# EAGLE schematic Solar ve rüzgar kartı (EAGLE 9.6.2)
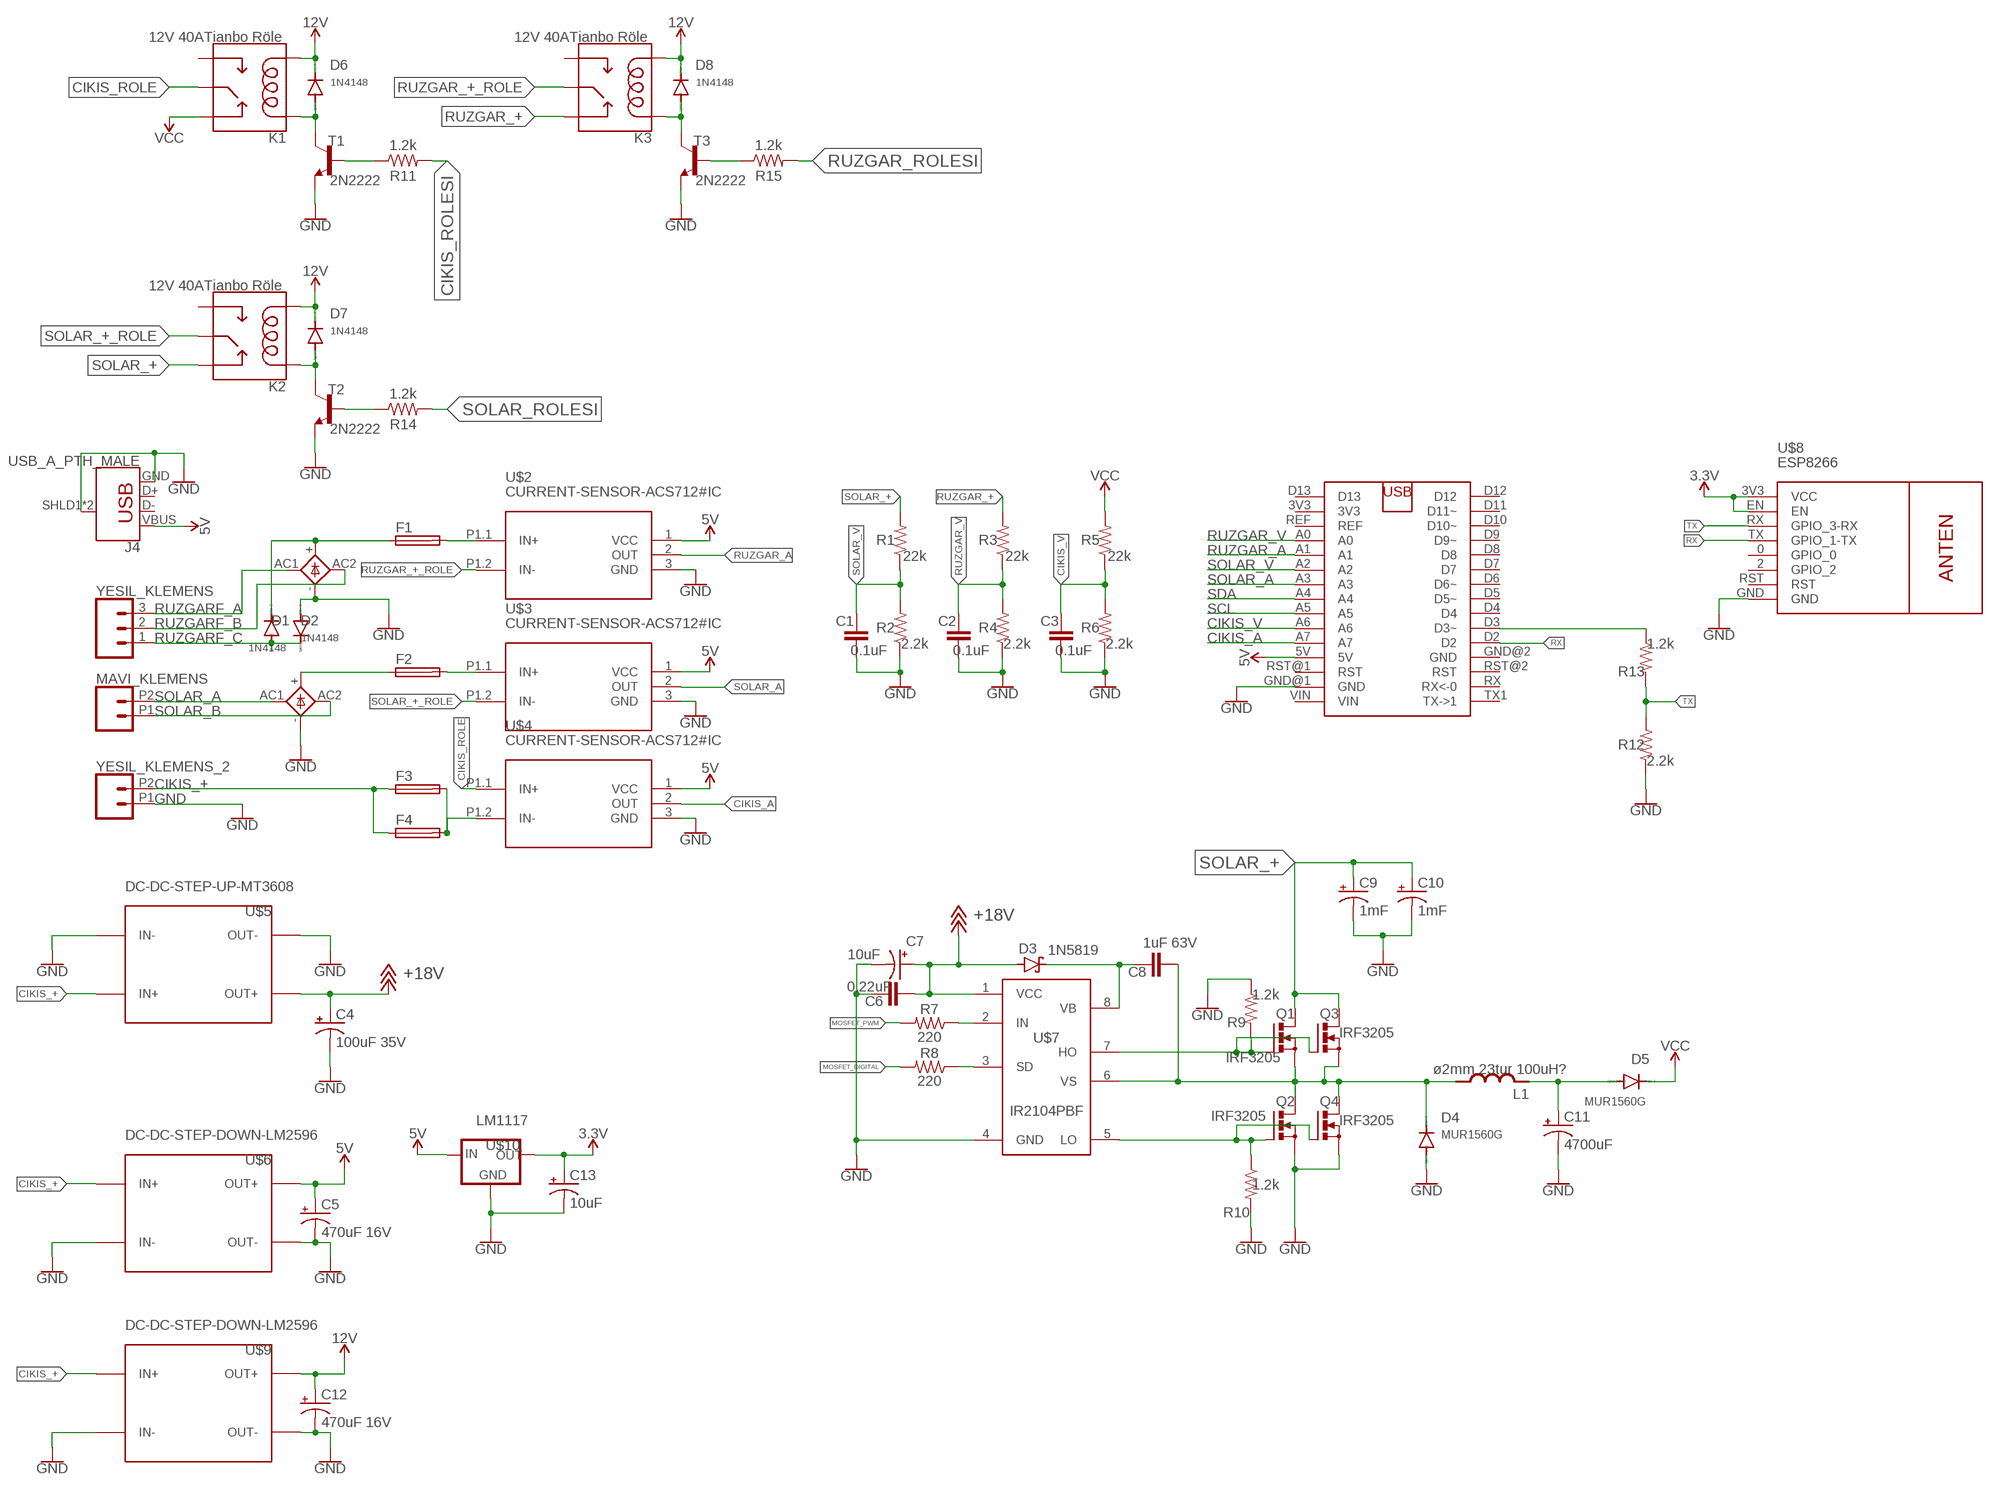
[diagram p0: schematic, sheet 1]

## Parts
B1  FB15  [FB15]
B2  FB15  [FB15]
C1  0.1uF  0.1UF-KIT-EZ-50V-20%  [CAP-PTH-SMALL-KIT]
C2  0.1uF  0.1UF-KIT-EZ-50V-20%  [CAP-PTH-SMALL-KIT]
C3  0.1uF  0.1UF-KIT-EZ-50V-20%  [CAP-PTH-SMALL-KIT]
C4  100uF 35V  100UF-POLAR-RADIAL-2.5MM-25V-20%  [CPOL-RADIAL-2.5MM-6.5MM]
C5  470uF 16V  100UF-POLAR-RADIAL-2.5MM-25V-20%  [CPOL-RADIAL-2.5MM-6.5MM]
C6  0.22uF  0.1UF-KIT-EZ-50V-20%  [CAP-PTH-SMALL-KIT]
C7  10uF  10UF-POLAR-RADIAL-2.5MM-25V-20%  [CPOL-RADIAL-2.5MM-5MM]
C8  1uF 63V  0.1UF-KIT-EZ-50V-20%  [CAP-PTH-SMALL-KIT]
C9  1mF  1000UF-RADIAL-5MM-25V-20%  [CPOL-RADIAL-5MM-10MM]
C10  1mF  1000UF-RADIAL-5MM-25V-20%  [CPOL-RADIAL-5MM-10MM]
C11  4700uF  1000UF-RADIAL-5MM-25V-20%  [CPOL-RADIAL-5MM-10MM]
C12  470uF 16V  100UF-POLAR-RADIAL-2.5MM-25V-20%  [CPOL-RADIAL-2.5MM-6.5MM]
C13  10uF  10UF-POLAR-RADIAL-2.5MM-25V-20%  [CPOL-RADIAL-2.5MM-5MM]
D1  1N4148  1N4148DO35-7  [DO35-7]
D2  1N4148  1N4148DO35-7  [DO35-7]
D3  1N5819  1N5819-B  [DO41-7.6]
D4  MUR1560G  DIODE-TO220V  [TO220ACS]
D5  MUR1560G  DIODE-TO220V  [TO220ACS]
D6  1N4148  1N4148DO35-7  [DO35-7]
D7  1N4148  1N4148DO35-7  [DO35-7]
D8  1N4148  1N4148DO35-7  [DO35-7]
F1  19560  [19560]
F2  19560  [19560]
F3  19560  [19560]
F4  19560  [19560]
J4  USB_A_PTH_MALE  [USB-A-H]
K1  12V 40ATianbo Röle  RELAY-SPDT-JZC-11F  [RELAY-JZC]
K2  12V 40ATianbo Röle  RELAY-SPDT-JZC-11F  [RELAY-JZC]
K3  12V 40ATianbo Röle  RELAY-SPDT-JZC-11F  [RELAY-JZC]
L1  ø2mm 23tur 100uH?  L10-2  [L10-2]
MAVI_KLEMENS  CONN_022.54MM_SCREWTERM  [1X02_2.54_SCREWTERM]
Q1  IRF3205  PMOSFET_NTO220BV  [TO220BV]
Q2  IRF3205  PMOSFET_NTO220BV  [TO220BV]
Q3  IRF3205  PMOSFET_NTO220BV  [TO220BV]
Q4  IRF3205  PMOSFET_NTO220BV  [TO220BV]
R1  22k  RESISTORAXIAL-0.3  [AXIAL-0.3]
R2  2.2k  RESISTORAXIAL-0.3  [AXIAL-0.3]
R3  22k  RESISTORAXIAL-0.3  [AXIAL-0.3]
R4  2.2k  RESISTORAXIAL-0.3  [AXIAL-0.3]
R5  22k  RESISTORAXIAL-0.3  [AXIAL-0.3]
R6  2.2k  RESISTORAXIAL-0.3  [AXIAL-0.3]
R7  220  RESISTORAXIAL-0.3  [AXIAL-0.3]
R8  220  RESISTORAXIAL-0.3  [AXIAL-0.3]
R9  1.2k  RESISTORAXIAL-0.3  [AXIAL-0.3]
R10  1.2k  RESISTORAXIAL-0.3  [AXIAL-0.3]
R11  1.2k  RESISTORAXIAL-0.3  [AXIAL-0.3]
R12  2.2k  RESISTORAXIAL-0.3  [AXIAL-0.3]
R13  1.2k  RESISTORAXIAL-0.3  [AXIAL-0.3]
R14  1.2k  RESISTORAXIAL-0.3  [AXIAL-0.3]
R15  1.2k  RESISTORAXIAL-0.3  [AXIAL-0.3]
T1  2N2222  2N2222-NPN-TO92-EBC  [TO92-EBC]
T2  2N2222  2N2222-NPN-TO92-EBC  [TO92-EBC]
T3  2N2222  2N2222-NPN-TO92-EBC  [TO92-EBC]
U$1  ARDUINO_NANO  [ARDUINO_NANO]
U$2  CURRENT-SENSOR-ACS712#IC  [CURRENT-SENSOR-ACS712#IC]
U$3  CURRENT-SENSOR-ACS712#IC  [CURRENT-SENSOR-ACS712#IC]
U$4  CURRENT-SENSOR-ACS712#IC  [CURRENT-SENSOR-ACS712#IC]
U$5  DC-DC-STEP-UP-MT3608  [DC-DC-STEP-UP-MT3608]
U$6  DC-DC-STEP-DOWN-LM2596  [DC-DC-STEP-DOWN-LM2596]
U$7  IR2104PBF  [DIP-8]
U$8  ESP8266  [ESP8266]
U$9  DC-DC-STEP-DOWN-LM2596  [DC-DC-STEP-DOWN-LM2596]
U$10  LM1117  [TO-220]
YESIL_KLEMENS  CONN_03-SCREW-5MM  [SCREWTERMINAL-5MM-3]
YESIL_KLEMENS_2  CONN_022.54MM_SCREWTERM  [1X02_2.54_SCREWTERM]

## Nets
3.3V: C13.1(+) U$8.3V3(VCC) U$8.EN U$10.2(OUT)
5V: C5.1(+) J4.VBUS U$1.5V U$2.1(VCC) U$3.1(VCC) U$4.1(VCC) U$6.OUT+ U$10.3(IN)
12V: C12.1(+) D6.C D7.C D8.C K1.1(COIL2) K2.1(COIL2) K3.1(COIL2) U$9.OUT+
+18V: C4.1(+) C6.2 C7.1(+) D3.A U$5.OUT+ U$7.1(VCC)
CIKIS_+: F3.1 F4.1 U$5.IN+ U$6.IN+ U$9.IN+ YESIL_KLEMENS_2.P2
CIKIS_A: U$1.A7 U$4.2(OUT)
CIKIS_ROLE: K1.4(MAIN) U$4.P1.1(IN+)
CIKIS_ROLESI: R11.P$2
CIKIS_V: C3.1 R5.P$1 R6.P$2 U$1.A6
GND: B1.- B2.- C1.2 C2.2 C3.2 C4.2(-) C5.2(-) C6.1 C7.2(-) C9.- C10.- C11.- C12.2(-) C13.2(-) D2.A D4.A J4.GND J4.SHLD1(SHIELD) J4.SHLD2(SHIELD) Q2.S Q4.S R2.P$1 R4.P$1 R6.P$1 R9.P$1 R10.P$2 R12.P$1 T1.E T2.E T3.E U$1.GND@1(GND) U$2.3(GND) U$3.3(GND) U$4.3(GND) U$5.IN- U$5.OUT- U$6.IN- U$6.OUT- U$7.4(GND) U$8.GND U$9.IN- U$9.OUT- U$10.1(GND) YESIL_KLEMENS_2.P1
MOSFET_DIGITAL: R8.P$2
MOSFET_PWM: R7.P$2
N$1: B1.+ F2.1
N$2: F1.2 U$2.P1.1(IN+)
N$3: B2.+ D1.C F1.1
N$4: F2.2 U$3.P1.1(IN+)
N$5: F3.2 F4.2 U$4.P1.2(IN-)
N$6: R7.P$1 U$7.2(IN)
N$7: R8.P$1 U$7.3(SD)
N$8: C8.1 D3.C U$7.8(VB)
N$9: C8.2 D4.C L1.P$1 L1.P$2 Q1.S Q2.D Q3.S Q4.D U$7.6(VS)
N$10: Q2.G Q4.G R10.P$1 U$7.5(LO)
N$11: Q1.G Q3.G R9.P$2 U$7.7(HO)
N$12: C11.+ D5.A L1.P$3 L1.P$4
N$13: R13.P$1 U$1.D3(D3~)
N$14: D6.A K1.5(COIL1) T1.C
N$15: R11.P$1 T1.B
N$16: D7.A K2.5(COIL1) T2.C
N$17: R14.P$1 T2.B
N$18: D8.A K3.5(COIL1) T3.C
N$19: R15.P$1 T3.B
RUZGAR_+: K3.2(NC) R3.P$2
RUZGAR_+_ROLE: K3.4(MAIN) U$2.P1.2(IN-)
RUZGAR_A: U$1.A1 U$2.2(OUT)
RUZGAR_ROLESI: R15.P$2
RUZGAR_V: C2.1 R3.P$1 R4.P$2 U$1.A0
RUZGARF_A: B2.AC1 YESIL_KLEMENS.3
RUZGARF_B: B2.AC2 YESIL_KLEMENS.2
RUZGARF_C: D1.A D2.C YESIL_KLEMENS.1
RX: U$1.D2 U$8.TX(GPIO_1-TX)
SCL: U$1.A5
SDA: U$1.A4
SOLAR_+: C9.+ C10.+ K2.2(NC) Q1.D Q3.D R1.P$2
SOLAR_+_ROLE: K2.4(MAIN) U$3.P1.2(IN-)
SOLAR_A: B1.AC1 MAVI_KLEMENS.P2 U$1.A3 U$3.2(OUT)
SOLAR_B: B1.AC2 MAVI_KLEMENS.P1
SOLAR_ROLESI: R14.P$2
SOLAR_V: C1.1 R1.P$1 R2.P$2 U$1.A2
TX: R12.P$2 R13.P$2 U$8.RX(GPIO_3-RX)
VCC: D5.C K1.2(NC) R5.P$2
Unconnected: J4.D+ J4.D- K1.3(NO) K2.3(NO) K3.3(NO) U$1.3V3 U$1.D4 U$1.D5(D5~) U$1.D6(D6~) U$1.D7 U$1.D8 U$1.D9(D9~) U$1.D10(D10~) U$1.D11(D11~) U$1.D12 U$1.D13 U$1.GND@2(GND) U$1.REF U$1.RST@1(RST) U$1.RST@2(RST) U$1.RX(RX<-0) U$1.TX1(TX->1) U$1.VIN U$8.0(GPIO_0) U$8.2(GPIO_2) U$8.RST

## Library data of the parts
B1 B2 = rectifier:FB15: FAGOR RECTIFIER grid 3 x 5 mm
C1-C3 = SparkFun-Capacitors:0.1UF: 0.1µF ceramic capacitors A capacitor is a passive two-terminal electrical component used to store electrical energy temporarily in an electric field.; PROD_ID: CAP-08370
C4 C5 C12 = SparkFun-Capacitors:100UF-POLAR: 100µF polarized capacitors A capacitor is a passive two-terminal electrical component used to store electrical energy temporarily in an electric field.; PROD_ID: CAP-08439; VALUE: 100uF
C6 C8 = SparkFun-Capacitors:0.1UF: 0.1µF ceramic capacitors A capacitor is a passive two-terminal electrical component used to store electrical energy temporarily in an electric field.; PROD_ID: CAP-08370; VALUE: 0.1uF
C7 C13 = SparkFun-Capacitors:10UF-POLAR: 10.0µF polarized capacitors A capacitor is a passive two-terminal electrical component used to store electrical energy temporarily in an electric field.; PROD_ID: CAP-08440
C9 C10 = SparkFun-Capacitors:1000UF: 1,000µF/1mF ceramic capacitors A capacitor is a passive two-terminal electrical component used to store electrical energy temporarily in an electric field. CAP-08070; PROD_ID: CAP-09538
C11 = SparkFun-Capacitors:1000UF: 1,000µF/1mF ceramic capacitors A capacitor is a passive two-terminal electrical component used to store electrical energy temporarily in an electric field. CAP-08070; PROD_ID: CAP-09538; VALUE: 1mF
D1 D2 D6-D8 = diode:1N4148: DIODE high speed (Philips)
D3 = diode:1N581*: 1.0A SCHOTTKY BARRIER RECTIFIER Source: http://www.diodes.com/datasheets/ds23001.pdf
D4 D5 = diode:DIODE-: DIODE
F1-F4 = fuse:19560: FUSE HOLDER TR5, Wickmann; MPN: 56000001009; OC_FARNELL: 1185363; OC_NEWARK: 15P8392
J4 = SparkFun-Connectors:USB_A: USB-A Connector Male and female variants, as well as PTH and SMT variants SparkFun Products: SparkFun XBee Explorer Dongle <https://www.sparkfun.com/products/11697> PTH Male SparkFun MicroView-USB Programmer <https://www.sparkfun.com/products/12924> SMT Male SparkFun USB Type A Female Breakout <https://www.sparkfun.com/products/12700> SMT Female; PROD_ID: CONN-08367; SF_ID: PRT-00437
K1-K3 = SparkFun-Electromechanical:RELAY-SPDT: SPDT Electromechanical Relay Single-pole, double-throw sealed relays. When current is applied to the coil, it throws a simple changeover switch, terminating the connection from the NC contact to ground and closing the NO contact. Use them to switch high voltage/high current devices. SparkFun Products JQX-15F: Relay SPDT Sealed - 20A <https://www.sparkfun.com/products/10924> (COM-10924) JZC-11F: Relay SPDT Sealed <https://www.sparkfun.com/products/100> (COM-00100); PROD_ID: COMP-09533; SF_SKU: COM-00100
L1 = lbr:L10-2
MAVI_KLEMENS YESIL_KLEMENS_2 = SparkFun-Connectors:CONN_02: Multi connection point. Often used as Generic Header-pin footprint for 0.1 inch spaced/style header connections On any of the 0.1 inch spaced packages, you can populate with these: Break Away Headers - Straight <https://www.sparkfun.com/products/116> (PRT-00116) Break Away Male Headers - Right Angle <https://www.sparkfun.com/products/553> (PRT-00553) Female Headers <https://www.sparkfun.com/products/115> (PRT-00115) Break Away Headers - Machine Pin <https://www.sparkfun.com/products/117> (PRT-00117) Break Away Female Headers - Swiss Machine Pin <https://www.sparkfun.com/products/743> (PRT-00743) For SCREWTERMINALS and SPRING TERMINALS visit here: Screw Terimnals on SparkFun.com <https://www.sparkfun.com/search/results?term=Screw+Terminals> (5mm/3.5mm/2.54mm spacing) This device is also useful as a general connection point to wire up your design to another part of your project. Our various solder wires solder well into these plated through hole pads. Hook-Up Wire - Assortment (Stranded, 22 AWG) <https://www.sparkfun.com/products/11375> (PRT-11375) Hook-Up Wire - Assortment (Solid Core, 22 AWG) <https://www.sparkfun.com/products/11367> (PRT-11367) View the entire wire category on our website here <https://www.sparkfun.com/categories/141> Special notes: Molex polarized connector foot print use with: PRT-08233 with associated crimp pins and housings. 2.54_SCREWTERM for use with PRT-10571. 3.5mm Screw Terminal footprints for PRT-08084 5mm Screw Terminal footprints for use with PRT-08432
Q1-Q4 = transistor-power:PMOSFET_N: Power MOSFET N-Channel
R1-R15 = SparkFun-Resistors:RESISTOR: Generic Resistor Package
T1-T3 = transistor-neu-to92:*-NPN-: NPN Transistror
U$1 = El_yapimi:ARDUINO_NANO
U$2-U$4 = diy-modules:CURRENT-SENSOR-ACS712#IC: Isolated Bipolar Current Sensors based on ACS712 chip Symbol with input pins More details available here: http://embedded-lab.com/blog/a-brief-overview-of-allegro-acs712-current-sensor-part-1/ Click here to find device on ebay.com <http://www.ebay.com/sch/acs712+module> Note: There are many available versions with different pinout. Please check before use
U$5 = diy-modules:DC-DC-STEP-UP-MT3608: DC/DC Step-Up Regulator based on MT3608 chip MT3608 datasheet available here: https://www.olimex.com/Products/Breadboarding/BB-PWR-3608/resources/MT3608.pdf Click here to find device on ebay.com <http://www.ebay.com/sch/mt3608+module>; SPICEPREFIX: E
U$6 U$9 = diy-modules:DC-DC-STEP-DOWN-LM2596: DC/DC Step-Down Regulator based on LM2596-ADJ chip LM2596 datasheet available here: http://www.ti.com/lit/ds/symlink/lm2596.pdf Click here to find device on ebay.com <http://www.ebay.com/sch/lm2596+power+regulator>
U$7 = El_yapimi:IR2104PBF
U$8 = El_yapimi:ESP8266
U$10 = El_yapimi:LM1117
YESIL_KLEMENS = SparkFun-Connectors:CONN_03: Multi connection point. Often used as Generic Header-pin footprint for 0.1 inch spaced/style header connections On any of the 0.1 inch spaced packages, you can populate with these: Break Away Headers - Straight <https://www.sparkfun.com/products/116> (PRT-00116) Break Away Male Headers - Right Angle <https://www.sparkfun.com/products/553> (PRT-00553) Female Headers <https://www.sparkfun.com/products/115> (PRT-00115) Break Away Headers - Machine Pin <https://www.sparkfun.com/products/117> (PRT-00117) Break Away Female Headers - Swiss Machine Pin <https://www.sparkfun.com/products/743> (PRT-00743) Stackable Header - 3 Pin (Female, 0.1") <https://www.sparkfun.com/products/13875> (PRT-13875) For SCREWTERMINALS and SPRING TERMINALS visit here: Screw Terimnals on SparkFun.com <https://www.sparkfun.com/search/results?term=Screw+Terminals> (5mm/3.5mm/2.54mm spacing) This device is also useful as a general connection point to wire up your design to another part of your project. Our various solder wires solder well into these plated through hole pads. Hook-Up Wire - Assortment (Stranded, 22 AWG) <https://www.sparkfun.com/products/11375> (PRT-11375) Hook-Up Wire - Assortment (Solid Core, 22 AWG) <https://www.sparkfun.com/products/11367> (PRT-11367) View the entire wire category on our website here <https://www.sparkfun.com/categories/141> Special notes: Molex polarized connector foot print use with SKU : PRT-08232 with associated crimp pins and housings.; PROD_ID: CONN-10134; SF_SKU: PRT-08433